# Altium project ACCLOGGER.PrjPcb
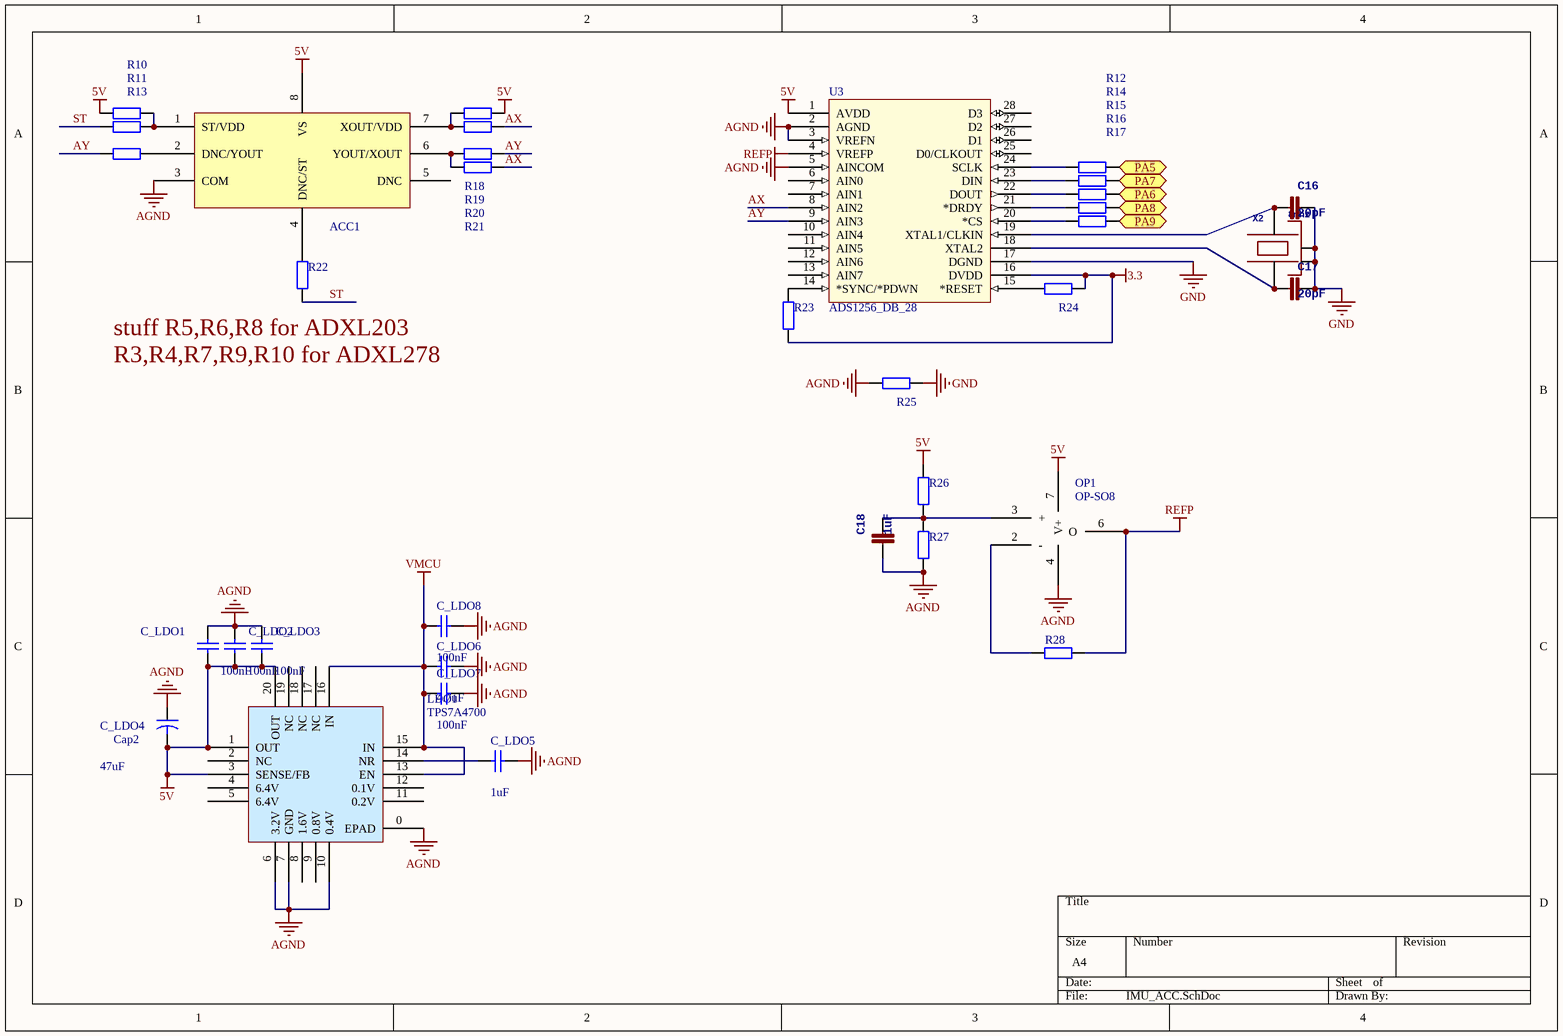
[diagram p0: IMU_ACC.SchDoc]
2 sheets, 73 parts. Net scope: flat (ports and power ports of the same name join across sheets).
Board file: ACCLOGGER.PcbDoc
Sheets:
  IMU_ACC.SchDoc
  MCU.SchDoc

## Sheet IMU_ACC.SchDoc
size A4

### Parts
ACC1  ACC-8  [ADXL203]  (value not drawn)
C16  20pF  [0402]
C17  20pF  [0402]
C18  1uF  [0603]
C_LDO1  value 100nF  [0603]
C_LDO2  value 100nF  [0603]
C_LDO3  value 100nF  [0603]
C_LDO4  Cap2  value 47uF  [1210]
C_LDO5  value 1uF  [0603]
C_LDO6  value 4.7uF  [0603]
C_LDO7  value 100nF  [0603]
C_LDO8  value 100nF  [1210]
LDO1  TPS7A4700  [TPS7A4700 - b]
OP1  OP-SO8  [D8]
R10  (no value)  [0402]
R11  (no value)  [0402]
R12  (no value)  [0402]
R13  (no value)  [0402]
R14  (no value)  [0402]
R15  (no value)  [0402]
R16  (no value)  [0402]
R17  (no value)  [0402]
R18  (no value)  [0402]
R19  (no value)  [0402]
R20  (no value)  [0402]
R21  (no value)  [0402]
R22  (no value)  [0402]
R23  (no value)  [0402]
R24  (no value)  [0402]
R25  (no value)  [0402]
R26  (no value)  [0603]
R27  (no value)  [0603]
R28  (no value)  [0402]
U3  ADS1256_DB_28  [DB28-L]
X2  8mhz  [OSCILLATOR-3.2X2.5]

### Ports
PA5, PA6, PA7, PA8, PA9

### Nets
3.3: R23.2 R24.2 U3.16(DVDD)
5V: ACC1.8(VS) C_LDO1.2 C_LDO2.2 C_LDO3.2 C_LDO4.2 LDO1.1(OUT) LDO1.3(SENSE/FB) LDO1.20(OUT) OP1.7(V+) R10.1 R18.2 R26.2 U3.1(AVDD)
AGND: ACC1.3(COM) C18.2 C_LDO1.1 C_LDO2.1 C_LDO3.1 C_LDO4.1 C_LDO5.1 C_LDO6.2 C_LDO7.2 C_LDO8.2 LDO1.0(EPAD) LDO1.6(3.2V) LDO1.7(GND) LDO1.10(0.4V) OP1.4 R25.1 R27.1 U3.2(AGND) U3.3(VREFN) U3.5(AINCOM)
GND: C16.1 C17.1 R25.2 U3.17(DGND) X2.2(NC_2) X2.4(NC_4)
REFP: OP1.6(O) R28.1 U3.4(VREFP)
VMCU: C_LDO6.1 C_LDO7.1 C_LDO8.1 LDO1.13(EN) LDO1.15(IN) LDO1.16(IN)
AX: R19.2 R21.2 U3.8(AIN2)
AY: R13.1 R20.2 U3.9(AIN3)
ST: R11.1 R22.1
NetACC1_1: ACC1.1(ST/VDD) R10.2 R11.2
NetACC1_2: ACC1.2(DNC/YOUT) R13.2
NetACC1_4: ACC1.4(DNC/ST) R22.2
NetACC1_6: ACC1.6(YOUT/XOUT) R20.1 R21.1
NetACC1_7: ACC1.7(XOUT/VDD) R18.1 R19.1
NetC16_2: C16.2 U3.19(XTAL1/CLKIN) X2.3
NetC17_2: C17.2 U3.18(XTAL2) X2.1
NetC18_1: C18.1 OP1.3(+) R26.1 R27.2
NetC_LDO5_2: C_LDO5.2 LDO1.14(NR)
NetMCU1_21: R12.2 ; port PA5
NetMCU1_22: R15.2 ; port PA6
NetMCU1_23: R14.2 ; port PA7
NetMCU1_41: R16.2 ; port PA8
NetMCU1_42: R17.2 ; port PA9
NetOP1_2: OP1.2(-) R28.2
NetR12_1: R12.1 U3.24(SCLK)
NetR14_1: R14.1 U3.23(DIN)
NetR15_1: R15.1 U3.22(DOUT)
NetR16_1: R16.1 U3.21(*DRDY)
NetR17_1: R17.1 U3.20(*CS)
NetR23_1: R23.1 U3.14(*SYNC/*PDWN)
NetR24_1: R24.1 U3.15(*RESET)

Not connected (* = marked no-connect by the designer): ACC1 5(DNC); LDO1 2(NC) 4(6.4V) 5(6.4V) 8(1.6V) 9(0.8V) 11(0.2V) 12(0.1V) 17(NC) 18(NC) 19(NC); U3 6(AIN0) 7(AIN1) 10(AIN4) 11(AIN5) 12(AIN6) 13(AIN7) 25(D0/CLKOUT) 26(D1) 27(D2) 28(D3)

### Notes on the sheet
- (near R22) stuff R5,R6,R8 for ADXL203
- R3,R4,R7,R9,R10 for ADXL278

### Library data of the parts
ACC1 = ACC-8: Imported; RefDes: RefDes; Type: DEV; Value: Value
C16-C18 = CAP0402-CAP: 电容; PARTNO: CC0402ZRY5V7BB104
C_LDO1-C_LDO3 C_LDO5-C_LDO8 = Cap: Capacitor; Published: 8-Jun-2000; LatestRevisionDate: 17-Jul-2002; LatestRevisionNote: Re-released for DXP Platform.; PackageReference: RAD-0.3; Publisher: Altium Limited; PackageDescription: Radial Cap, Thru-Hole; 2 Leads; 0.3 in Pin Spacing
C_LDO4 = Cap2: Capacitor; Published: 23-Sep-2002; PackageReference: CAPR5-4X5; Publisher: Altium Limited; PackageDescription: Capacitor; 2 Leads
R10 R11 R13 R18-R22 R25-R28 = Res2: Resistor; Value: 0R; Published: 8-Jun-2000; LatestRevisionDate: 17-Jul-2002; LatestRevisionNote: Re-released for DXP Platform.; PackageReference: AXIAL-0.4; Publisher: Altium Limited; PackageDescription: Axial Device, Thru-Hole; 2 Leads; 0.4 in Pin Spacing
R12 R14-R17 R23 R24 = Res2: Resistor; Value: 200R; Published: 8-Jun-2000; LatestRevisionDate: 17-Jul-2002; LatestRevisionNote: Re-released for DXP Platform.; PackageReference: AXIAL-0.4; Publisher: Altium Limited; PackageDescription: Axial Device, Thru-Hole; 2 Leads; 0.4 in Pin Spacing
U3 = ADS1256_DB_28: Imported; Manufacturer: Texas Instruments; INDUSTRY_STD_PKG_TYPE: SSOP; FAMILY_NAME: PRECISION ADC (<=10MSPS); PIN_COUNT: 28; PACKAGE_DESIGNATOR: DB; Datasheet URL: http://www.ti.com/lit/gpn/ADS1256; GENERIC_PART_NUMBER: ADS1256; RefDes: RefDes; Type: DEV; Value: Value
X2 = OSCILLATOR-3.2X2.5: Crystal Oscillator in 3.2x2.5 SMD

## Sheet MCU.SchDoc
size A4
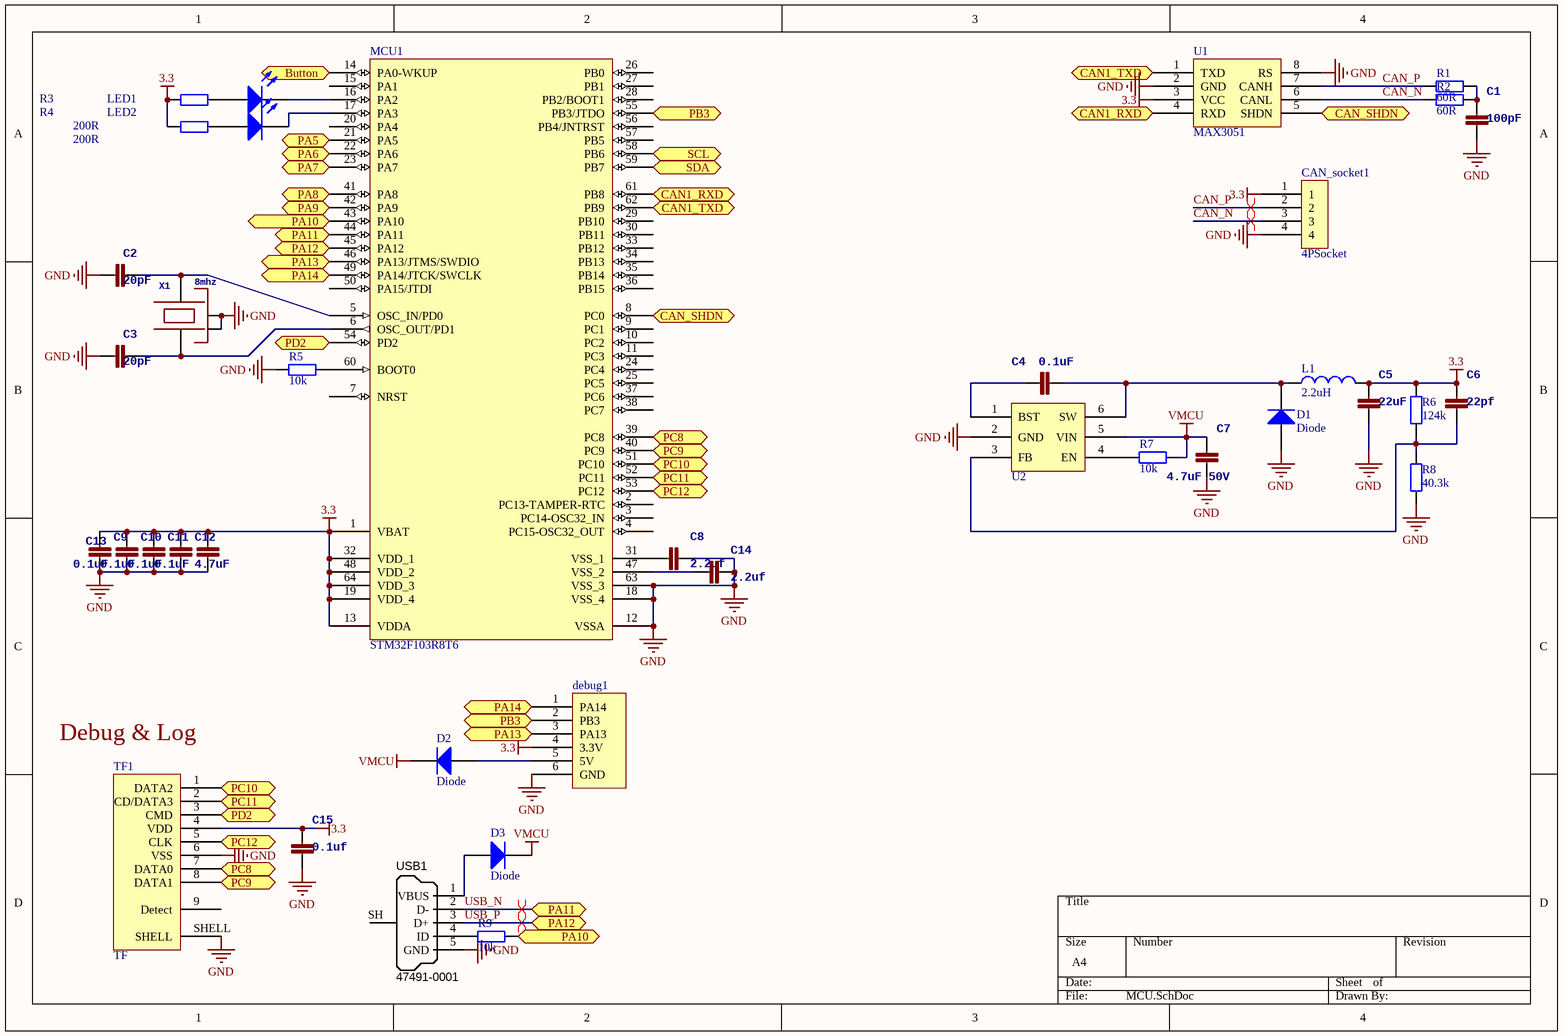
[diagram p1: MCU.SchDoc]

### Parts
C1  100pF  [0402]
C2  20pF  [0603]
C3  20pF  [0603]
C4  0.1uF  [0402]
C5  22uF  [0805]
C6  22pf  [0402]
C7  4.7uF 50V  [0805]
C8  2.2uf  [0603]
C9  0.1uF  [0402]
C10  0.1uF  [0402]
C11  0.1uF  [0402]
C12  4.7uF  [0603]
C13  0.1uF  [0402]
C14  2.2uf  [0603]
C15  0.1uf  [0402]
CAN_socket1  4PSocket  [4pSocket-s]
D1  Diode  [0805]
D2  Diode  [0805]
D3  Diode  [0805]
debug1  debug  [WFRSM125]  (value not drawn)
L1  2.2uH  [1210]
LED1  LED0  [0603]  (value not drawn)
LED2  LED0  [0603]  (value not drawn)
MCU1  STM32F103R8T6  [LQFP64_N]
R1  60R  [0402]
R2  60R  [0402]
R3  200R  [0603]
R4  200R  [0603]
R5  10k  [0402]
R6  124k  [0402]
R7  10k  [0402]
R8  40.3k  [0402]
R9  10k  [0402]
TF1  TF  [TF]
U1  MAX3051  [SOT-8]
U2  MP2451  [SOT-23-6L]  (value not drawn)
USB1  Manufacturer Part Number 1: 47491-0001  [MOLEX-47346-0001]  (hidden comment: USB Micro Type B)
X1  8mhz  [OSCILLATOR-3.2X2.5]

### Ports
Button, CAN1_RXD, CAN1_TXD, CAN_SHDN, PA5, PA6, PA7, PA8, PA9, PA10, PA11, PA12, PA13, PA14, PB3, PC8, PC9, PC10, PC11, PC12, PD2, SCL, SDA

### Nets
3.3: C5.2 C6.2 C9.1 C10.1 C11.1 C12.2 C13.1 C15.2 CAN_socket1.1 debug1.4(3.3V) L1.2 MCU1.1(VBAT) MCU1.13(VDDA) MCU1.19(VDD_4) MCU1.32(VDD_1) MCU1.48(VDD_2) MCU1.64(VDD_3) R3.1 R4.1 R6.1 TF1.4(VDD) U1.3(VCC)
GND: C1.1 C2.2 C3.2 C5.1 C7.1 C8.2 C9.2 C10.2 C11.2 C12.1 C13.2 C14.2 C15.1 CAN_socket1.4 D1.1(A) debug1.6(GND) MCU1.12(VSSA) MCU1.18(VSS_4) MCU1.63(VSS_3) R5.2 R8.2 TF1.6(VSS) TF1.SHELL U1.2(GND) U1.8(RS) U2.2(GND) USB1.5(GND) X1.2(NC_2) X1.4(NC_4)
VMCU: C7.2 D2.2(K) D3.2(K) R7.2 U2.5(VIN)
CAN_N: CAN_socket1.3 R2.2 U1.6(CANL)
CAN_P: CAN_socket1.2 R1.2 U1.7(CANH)
USB_N: MCU1.44(PA11) USB1.2(D-) ; port PA11
USB_P: MCU1.45(PA12) USB1.3(D+) ; port PA12
NetC1_2: C1.2 R1.1 R2.1
NetC2_1: C2.1 MCU1.5(OSC_IN/PD0) X1.3
NetC3_1: C3.1 MCU1.6(OSC_OUT/PD1) X1.1
NetC4_1: C4.1 D1.2(K) L1.1 U2.6(SW)
NetC4_2: C4.2 U2.1(BST)
NetC6_1: C6.1 R6.2 R8.1 U2.3(FB)
NetC8_1: C8.1 MCU1.31(VSS_1)
NetC14_1: C14.1 MCU1.47(VSS_2)
NetD2_1: D2.1(A) debug1.5(5V)
NetD3_1: D3.1(A) USB1.1(VBUS)
Netdebug1_1: debug1.1(PA14) MCU1.49(PA14/JTCK/SWCLK) ; port PA14
Netdebug1_2: debug1.2(PB3) MCU1.55(PB3/JTDO) ; port PB3
Netdebug1_3: debug1.3(PA13) MCU1.46(PA13/JTMS/SWDIO) ; port PA13
NetLED1_1: LED1.1(A) R3.2
NetLED1_2: LED1.2(K) MCU1.16(PA2)
NetLED2_1: LED2.1(A) R4.2
NetLED2_2: LED2.2(K) MCU1.17(PA3)
NetMCU1_8: MCU1.8(PC0) U1.5(SHDN) ; port CAN_SHDN
NetMCU1_14: MCU1.14(PA0-WKUP) ; port Button
NetMCU1_21: MCU1.21(PA5) ; port PA5
NetMCU1_22: MCU1.22(PA6) ; port PA6
NetMCU1_23: MCU1.23(PA7) ; port PA7
NetMCU1_39: MCU1.39(PC8) TF1.7(DATA0) ; port PC8
NetMCU1_40: MCU1.40(PC9) TF1.8(DATA1) ; port PC9
NetMCU1_41: MCU1.41(PA8) ; port PA8
NetMCU1_42: MCU1.42(PA9) ; port PA9
NetMCU1_43: MCU1.43(PA10) R9.1 ; port PA10
NetMCU1_51: MCU1.51(PC10) TF1.1(DATA2) ; port PC10
NetMCU1_52: MCU1.52(PC11) TF1.2(CD/DATA3) ; port PC11
NetMCU1_53: MCU1.53(PC12) TF1.5(CLK) ; port PC12
NetMCU1_54: MCU1.54(PD2) TF1.3(CMD) ; port PD2
NetMCU1_58: MCU1.58(PB6) ; port SCL
NetMCU1_59: MCU1.59(PB7) ; port SDA
NetMCU1_60: MCU1.60(BOOT0) R5.1
NetMCU1_61: MCU1.61(PB8) U1.4(RXD) ; port CAN1_RXD
NetMCU1_62: MCU1.62(PB9) U1.1(TXD) ; port CAN1_TXD
NetR7_1: R7.1 U2.4(EN)
NetR9_2: R9.2 USB1.4(ID)

Not connected (* = marked no-connect by the designer): MCU1 2(PC13-TAMPER-RTC) 3(PC14-OSC32_IN) 4(PC15-OSC32_OUT) 7(NRST) 9(PC1) 10(PC2) 11(PC3) 15(PA1) 20(PA4) 24(PC4) 25(PC5) 26(PB0) 27(PB1) 28(PB2/BOOT1) 29(PB10) 30(PB11) 33(PB12) 34(PB13) 35(PB14) 36(PB15) 37(PC6) 38(PC7) 50(PA15/JTDI) 56(PB4/JNTRST) 57(PB5); TF1 9(Detect); USB1 SH(Shell)

### Layout directives
differential pair: CAN_N, CAN_P, USB_N, USB_P

### Notes on the sheet
- (near TF1) Debug & Log

### Library data of the parts
C1-C15 = CAP0402-CAP: 电容; PARTNO: CC0402ZRY5V7BB104
D1-D3 = Diode: Default Diode; Published: 8-Jun-2000; LatestRevisionDate: 17-Jul-2002; LatestRevisionNote: Re-released for DXP Platform.; PackageVersion: Sep-1996; PackageReference: SMC; Publisher: Altium Limited; PackageDescription: DO-214-AB/SMC; 2 C-Bend Leads; Body 7.9 x 5.9 mm, inc. leads (LxW); Code_JEDEC: DO-214-AB
L1 = Inductor: Code_IEC: 1005; Value: 10mH; Published: 8-Jun-2000; LatestRevisionDate: 29-May-2009; LatestRevisionNote: IPC-7351 Footprint Added.; PackageReference: 0402-A; Publisher: Altium Limited; PackageDescription: Chip Inductor; Code_JEITA: 0402
LED1 LED2 = LED0: Typical INFRARED GaAs LED; Published: 8-Jun-2000; LatestRevisionDate: 08-Jul-2005; LatestRevisionNote: Mech Layer 1 removed.; PackageReference: LED-0; Publisher: Altium Limited; PackageDescription: LED; 2 Leads
MCU1 = STM32F103R8T6: STM32 ARM-based 32-bit MCU with 64 Kbytes Flash, 64-pin LQFP, Industrial Temperature; Published: *; DatasheetVersion: *; PackageVersion: *; PackageReference: *; Publisher: *; PackageDescription: *; ComponentLink1Description: *; ComponentLink1URL: *; ComponentLink2Description: *; ComponentLink2URL: *
R1-R9 = Res2: 电阻; Value: 0Ohm; Published: 8-Jun-2000; LatestRevisionDate: 17-Jul-2002; LatestRevisionNote: Re-released for DXP Platform.; PackageReference: AXIAL-0.4; Publisher: Altium Limited; PackageDescription: Axial Device, Thru-Hole; 2 Leads; 0.4 in Pin Spacing
USB1 = USB_Micro_TypeB: Connector SMD USB Micro Type B middle mount; Manufacturer 1: Molex Inc; SCDType: undef; Package / Case: SMD; Supplier 1: Digi-Key; Supplier Part Number 1: WM17142CT-ND
X1 = OSCILLATOR-3.2X2.5: Crystal Oscillator in 3.2x2.5 SMD

## Nets that join several sheets
3.3: IMU_ACC (R23.2 R24.2 U3.16), MCU (22 pins)
GND: IMU_ACC (6 pins), MCU (29 pins)
VMCU: IMU_ACC (6 pins), MCU (5 pins)
NetMCU1_21: IMU_ACC (R12.2), MCU (MCU1.21)
NetMCU1_22: IMU_ACC (R15.2), MCU (MCU1.22)
NetMCU1_23: IMU_ACC (R14.2), MCU (MCU1.23)
NetMCU1_41: IMU_ACC (R16.2), MCU (MCU1.41)
NetMCU1_42: IMU_ACC (R17.2), MCU (MCU1.42)